# EasyEDA schematic SCH_TimeCortex_2026-06-23.json
TITLE: Sheet_1; REV: 1.0; Date: 2025-08-19; Sheet: 1/1; Drawn By: wdekoo123; Company: Your Company
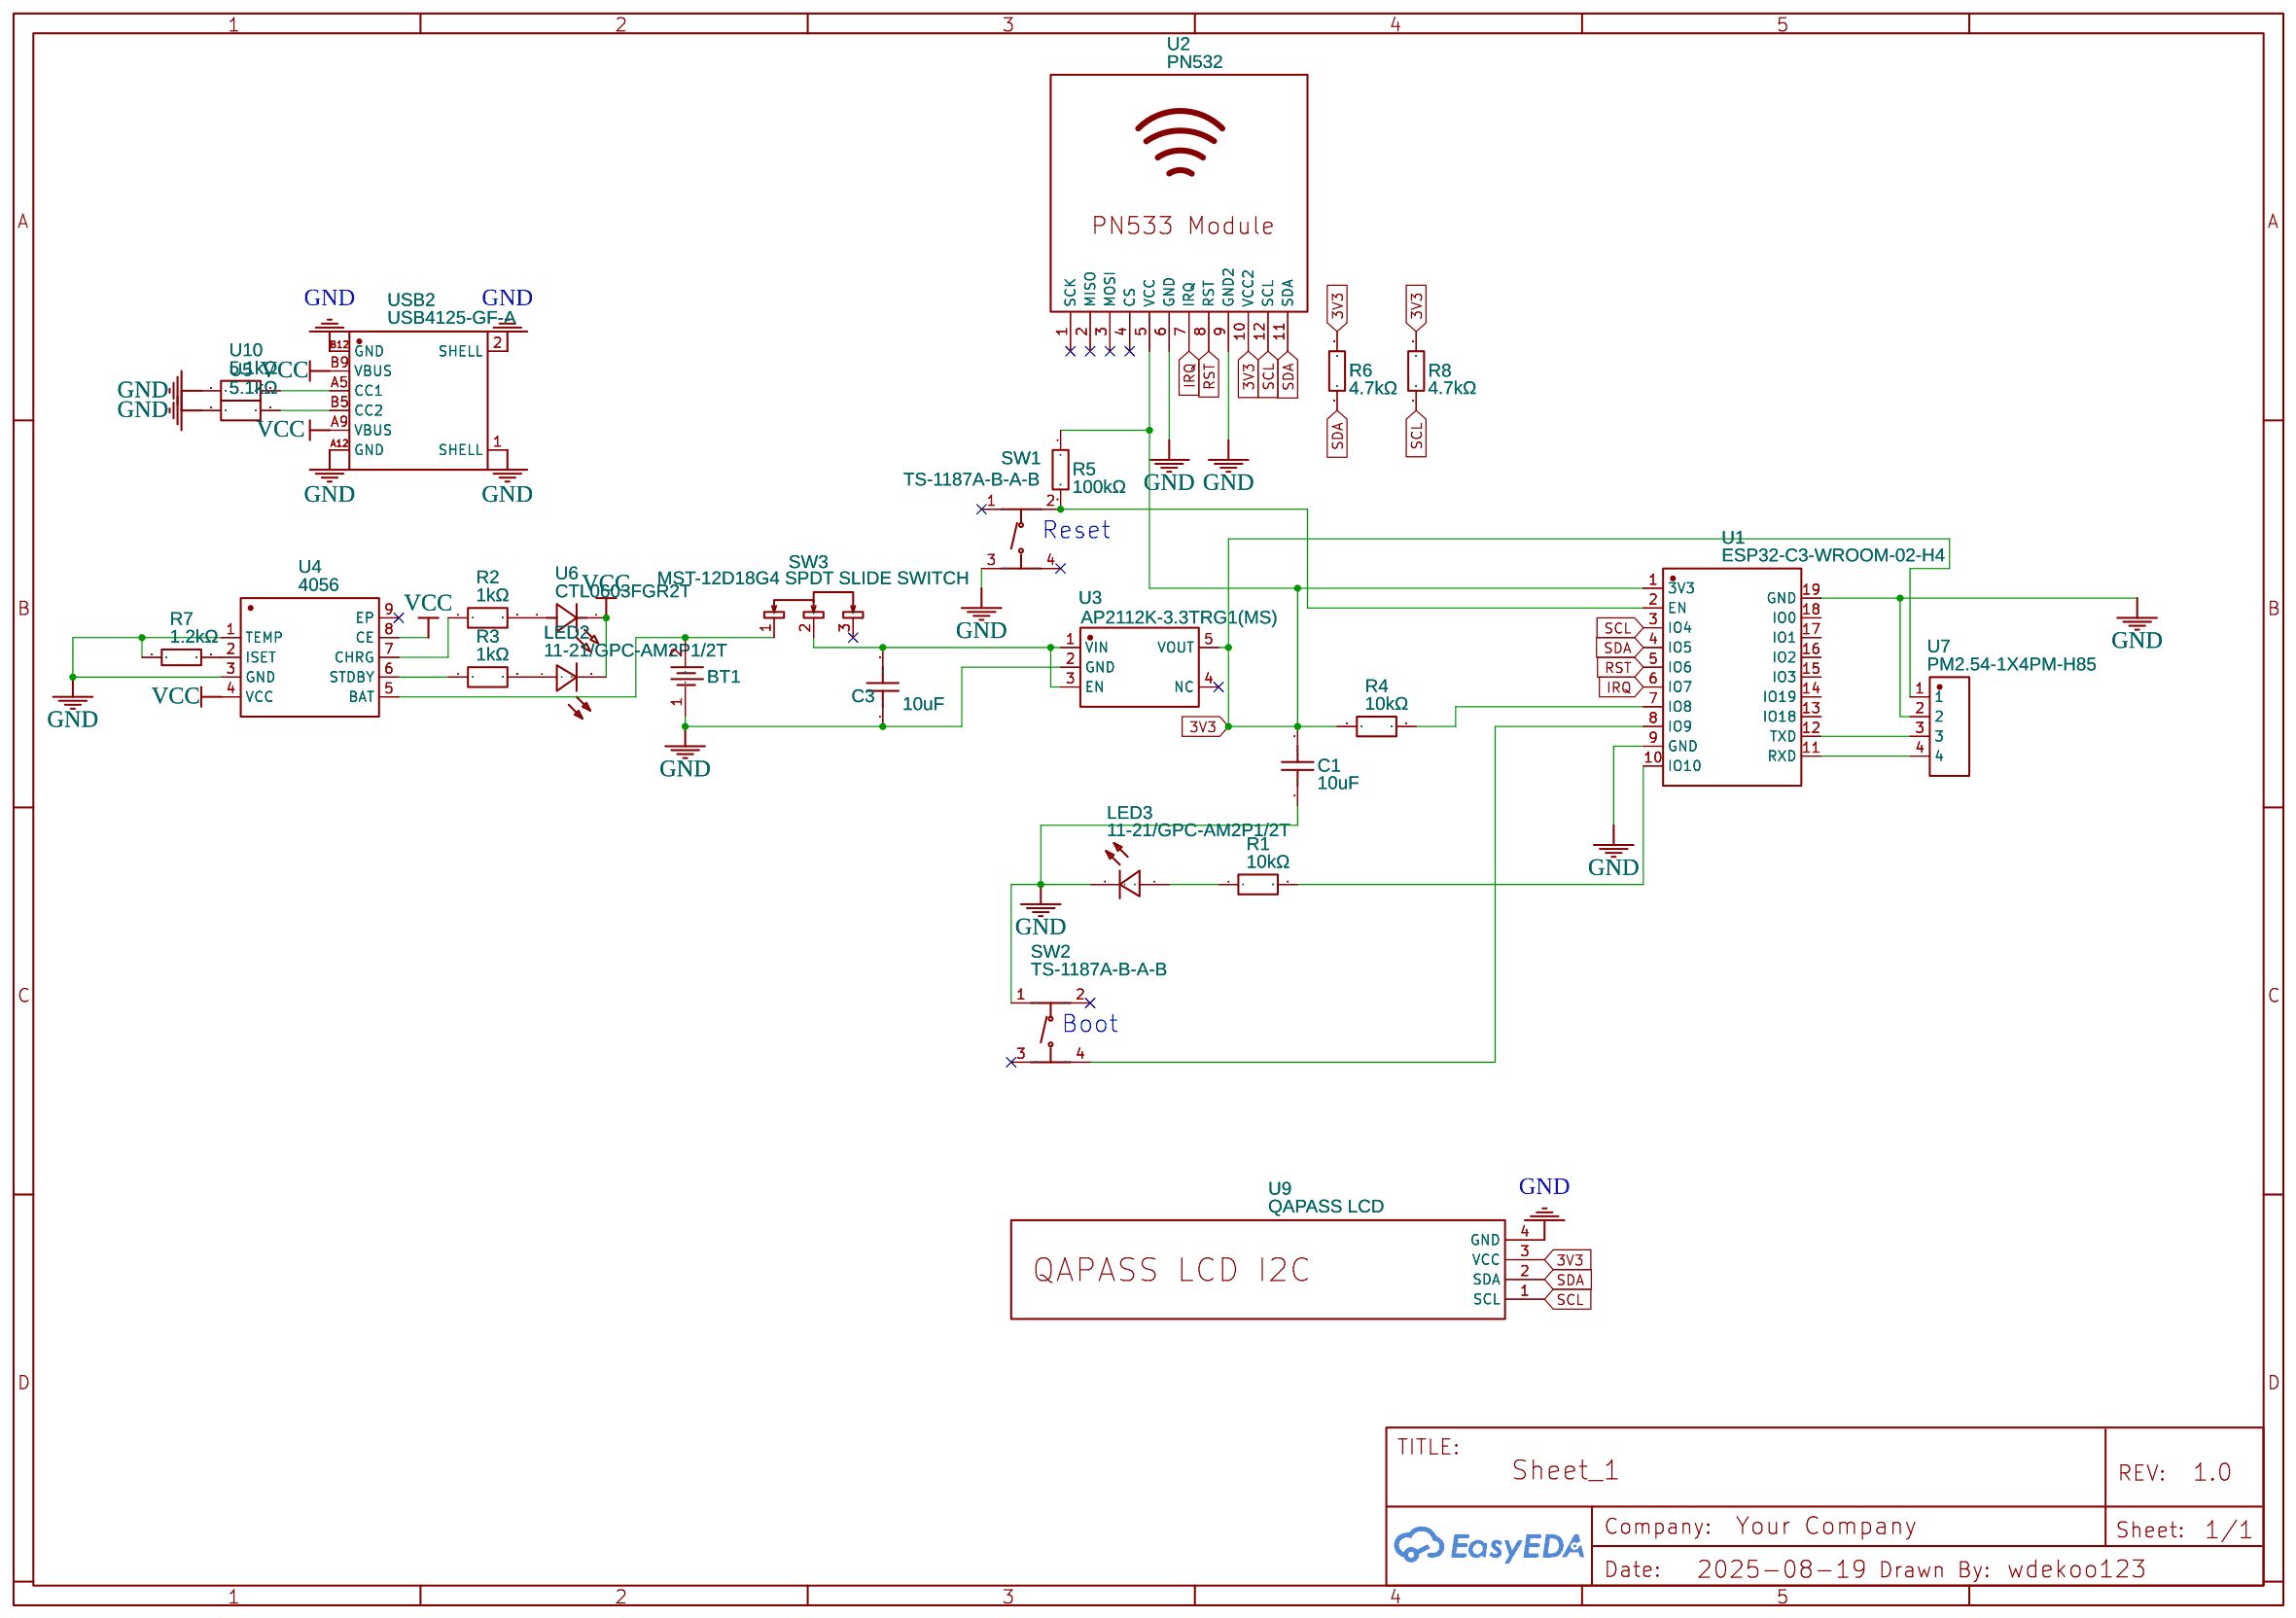
[diagram p0: schematic sheet]

## Parts
BT1  BH-18650-1  [BAT-TH_BH-18650-A1AJ005]
C1  10uF  [C0805]
C3  10uF  [C0805]
LED2  11-21/GPC-AM2P1/2T  [LED1206-R-RD_GREEN]
LED3  11-21/GPC-AM2P1/2T  [LED1206-R-RD_GREEN]
R1  10kΩ  [R0402]
R2  1kΩ  [R0805]
R3  1kΩ  [R0805]
R4  10kΩ  [R0402]
R5  100kΩ  [R0805]
R6  4.7kΩ  [R0402]
R7  1.2kΩ  [R1206]
R8  4.7kΩ  [R0402]
SW1  TS-1187A-B-A-B  [SW-SMD_4P-L5.1-W5.1-P3.70-LS6.5-TL_H1.5]
SW2  TS-1187A-B-A-B  [SW-SMD_4P-L5.1-W5.1-P3.70-LS6.5-TL_H1.5]
SW3  MST-12D18G4 SPDT SLIDE SWITCH  [SW-SMD_MST-12D18G4-SPDT-SLIDE-SWITCH]
U1  ESP32-C3-WROOM-02-H4  [WIFIM-SMD_18P-L20.0-W18.0-P1.50]
U2  PN532  [RFID_READER_PN532_BREAKOUT]
U3  AP2112K-3.3TRG1(MS)  [SOT-23-5_L2.9-W1.6-P0.95-LS2.7-BR]
U4  4056  [ESOP-8_L4.9-W3.9-P1.27-LS6.0-BL-EP]
U5  5.1kΩ  [R0603]
U6  CTL0603FGR2T  [LED0603-RD]
U7  PM2.54-1X4PM-H85  [HDR-TH_4P-P2.54-V-F]
U9  QAPASS LCD  [LCD]
U10  5.1kΩ  [R0603]
USB2  USB4125-GF-A  [USB-C-SMD_TYPE-C-6P]

## Library data of the parts
BT1 = BH-18650-1: Supplier: LCSC; Supplier Part: C49118395; Manufacturer: HanElectricity(瀚源); JLCPCB Part Class: Extended Part; Contributor: lcsc
C1 C3 = CL21A106KAYNNNE: Supplier: LCSC; Manufacturer: SAMSUNG(三星); Supplier Part: C15850; JLCPCB Part Class: Basic Part
LED2 LED3 = 11-21/GPC-AM2P1/2T: Contributor: LCSC; Supplier: LCSC; Supplier Part: C264329; Manufacturer: EVERLIGHT(亿光); JLCPCB Part Class: Extended Part
R1 R4 = AC0402FR-1310KL: Supplier: LCSC; Supplier Part: C5455563; Manufacturer: YAGEO(国巨); JLCPCB Part Class: Extended Part; Contributor: lcsc
R2 R3 = 0805W8D1001T5E: Contributor: LCSC; Supplier: LCSC; Supplier Part: C2767302; Manufacturer: UNI-ROYAL(厚声); JLCPCB Part Class: Extended Part
R5 = AR05DTDW1003: Contributor: LCSC; Supplier: LCSC; Supplier Part: C319970; Manufacturer: Viking(光颉); JLCPCB Part Class: Extended Part
R6 R8 = 0402WGF4701TCE: Supplier: LCSC; Manufacturer: UNI-ROYAL(厚声); Supplier Part: C25900; JLCPCB Part Class: Basic Part
R7 = 1206W4F1201T5E: Supplier: LCSC; Manufacturer: UNI-ROYAL(厚声); Supplier Part: C17891; JLCPCB Part Class: Extended Part
SW1 SW2 = TS-1187A-B-A-B: Contributor: LCSC; Supplier: LCSC; Supplier Part: C318884; Manufacturer: XKB Connection(中国星坤); JLCPCB Part Class: Basic Part
SW3 = MST-12D18G4 SPDT SLIDE SWITCH: Supplier: LCSC; Supplier Part: C49023767; Manufacturer: SHOU HAN(首韩); Manufacturer Part: MST-12D18G4 SPDT Slide Switch; JLCPCB Part Class: Extended Part; Contributor: lcsc
U1 = ESP32-C3-WROOM-02-H4: Contributor: LCSC; Supplier: LCSC; Supplier Part: C2944070; Manufacturer: ESPRESSIF(乐鑫); JLCPCB Part Class: Extended Part
U2 = PN532: Supplier Part: C49256; Supplier: LCSC; Manufacturer: ReliaPro; Manufacturer Part: Header2.54mm 1*8P; Contributor: JFK422
U3 = AP2112K-3.3TRG1(MS): Supplier: LCSC; Supplier Part: C22365427; Manufacturer: MSKSEMI(美森科); JLCPCB Part Class: Extended Part; Contributor: lcsc
U4 = 4056: Contributor: LCSC; Supplier: LCSC; Supplier Part: C392766; Manufacturer: RONGHE(融和); JLCPCB Part Class: Extended Part
U5 U10 = FRC0603J512 TS: Supplier: LCSC; Supplier Part: C2907114; Manufacturer: FOJAN(富捷); Contributor: lcsc; JLCPCB Part Class: Extended Part
U6 = CTL0603FGR2T: Supplier: LCSC; Supplier Part: C5634554; Manufacturer: Venkel; Contributor: lcsc; JLCPCB Part Class: Extended Part
U7 = PM2.54-1X4PM-H85: Supplier: LCSC; Supplier Part: C42431839; Manufacturer: JXTCONN(聚兴泰); Contributor: lcsc; JLCPCB Part Class: Extended Part
U9 = QAPASS LCD: Contributor: josephhuangbb
USB2 = USB4125-GF-A: Supplier: LCSC; Supplier Part: C3151650; Manufacturer: GCT; JLCPCB Part Class: Extended Part; Contributor: lcsc

## Nets
3V3: C1.2 R4.1 R5.1 R6.2 R8.2 U1.1(3V3) U2.5(VCC) U2.10(VCC2) U3.5(VOUT) U7.1 U9.3(VCC)
GND: BT1.1 C1.1 C3.1 LED3.2(K) R7.1 SW1.3(C) SW2.1(A) U1.9(GND) U1.19(GND) U2.6(GND) U2.9(GND2) U3.2(GND) U4.1(TEMP) U4.3(GND) U5.1 U7.2 U9.4(GND) U10.1 USB2.1(SHELL) USB2.2(SHELL) USB2.A12(GND) USB2.B12(GND)
VCC: LED2.2(K) U4.4(VCC) U4.8(CE) U6.1(K) USB2.A9(VBUS) USB2.B9(VBUS)
IRQ: U1.6(IO7) U2.7(IRQ)
RST: U1.5(IO6) U2.8(RST)
SCL: R8.1 U1.3(IO4) U2.12(SCL) U9.1(SCL)
SDA: R6.1 U1.4(IO5) U2.11(SDA) U9.2(SDA)
Net-(BT1-2): BT1.2 SW3.1 U4.5(BAT)
Net-(C3-2): C3.2 SW3.2 U3.1(VIN) U3.3(EN)
Net-(LED2-1): LED2.1(A) R3.2
Net-(LED3-1): LED3.1(A) R1.1
Net-(R1-2): R1.2 U1.10(IO10)
Net-(R2-1): R2.1 U4.7(CHRG)
Net-(R2-2): R2.2 U6.2(A)
Net-(R3-1): R3.1 U4.6(STDBY)
Net-(R4-2): R4.2 U1.7(IO8)
Net-(R5-2): R5.2 SW1.2(B) U1.2(EN)
Net-(R7-2): R7.2 U4.2(ISET)
Net-(SW2-4): SW2.4(D) U1.8(IO9)
Net-(U1-11): U1.11(RXD) U7.4
Net-(U1-12): U1.12(TXD) U7.3
Net-(U5-2): U5.2 USB2.B5(CC2)
Net-(U10-2): U10.2 USB2.A5(CC1)

Not connected (* = marked no-connect by the designer): SW1 1(A)* 4(D)*; SW2 2(B)* 3(C)*; SW3 3*; U1 13(IO18) 14(IO19) 15(IO3) 16(IO2) 17(IO1) 18(IO0); U2 1(SCK)* 2(MISO)* 3(MOSI)* 4(CS)*; U3 4(NC)*; U4 9(EP)*

## Notes on the sheet
- Reset
- Boot
